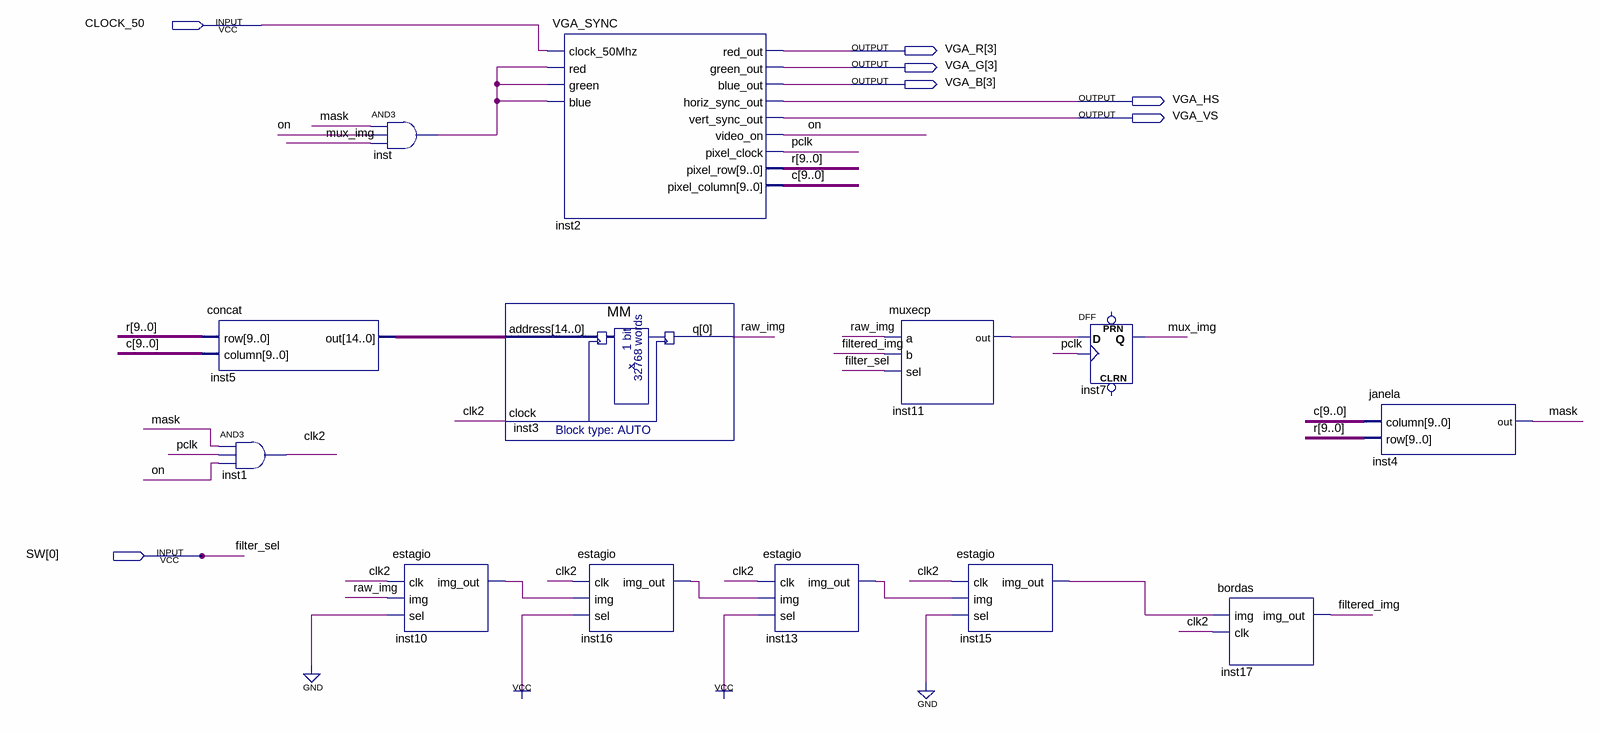
[diagram p0: schematic sheet]
// Quartus schematic pratica3.bdf as structural Verilog: 13 symbols, 7 pins
module pratica3 (
  input  CLOCK_50,
  input  [0:0] SW,
  output [3:3] VGA_R,
  output [3:3] VGA_G,
  output [3:3] VGA_B,
  output VGA_HS,
  output VGA_VS
);

  wire clk2, filtered_img, inst10_img_out, inst11_out, inst13_img_out, inst15_img_out, inst16_img_out,
       inst_out, mask, mux_img, on, pclk, raw_img;
  wire [9:0] c, r;
  wire [14:0] inst5_out;

  concat inst5 (.row(r), .column(c), .out(inst5_out));
  and inst1 (clk2, mask, pclk, on);
  and inst (inst_out, mask, on, mux_img);
  estagio inst10 (.clk(clk2), .img(raw_img), .sel(1'b0), .img_out(inst10_img_out));
  MM inst3 (.address(inst5_out), .clock(clk2), .q(raw_img));
  VGA_SYNC inst2 (
    .clock_50Mhz(CLOCK_50), .red(inst_out), .green(inst_out), .blue(inst_out), .red_out(VGA_R[3]),
    .green_out(VGA_G[3]), .blue_out(VGA_B[3]), .horiz_sync_out(VGA_HS), .vert_sync_out(VGA_VS),
    .video_on(on), .pixel_clock(pclk), .pixel_row(r), .pixel_column(c));
  estagio inst16 (.clk(clk2), .img(inst10_img_out), .sel(1'b1), .img_out(inst16_img_out));
  estagio inst13 (.clk(clk2), .img(inst16_img_out), .sel(1'b1), .img_out(inst13_img_out));
  muxecp inst11 (.a(raw_img), .b(filtered_img), .sel(SW[0]), .out(inst11_out));
  estagio inst15 (.clk(clk2), .img(inst13_img_out), .sel(1'b0), .img_out(inst15_img_out));
  DFF inst7 (.CLK(pclk), .D(inst11_out), .Q(mux_img));  // open: CLRN, PRN
  bordas inst17 (.img(inst15_img_out), .clk(clk2), .img_out(filtered_img));
  janela inst4 (.column(c), .row(r), .out(mask));

  // Other names for the same wires on the sheet: filter_sel = SW[0]
endmodule
